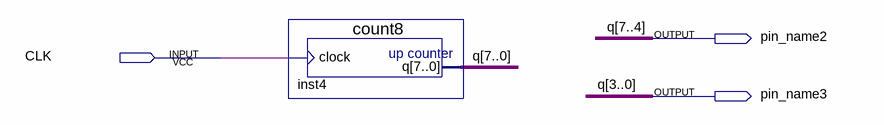
[diagram p0: schematic sheet]
// Quartus schematic alutest.bdf as structural Verilog: 1 symbols, 3 pins
module alutest (
  input  CLK,
  output pin_name2,
  output pin_name3
);

  wire [7:0] q;

  count8 inst4 (.clock(CLK), .q(q));
endmodule
